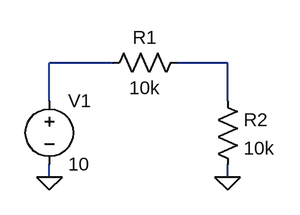
[diagram p0: schematic Draft1.asc]
Draft1.asc, the LTspice schematic file:
Version 4.1
SHEET 1 880 680
WIRE 32 144 -48 144
WIRE 176 144 112 144
WIRE -48 192 -48 144
WIRE 176 192 176 144
WIRE -48 288 -48 272
WIRE 176 288 176 272
FLAG -48 288 0
FLAG 176 288 0
SYMBOL res 128 128 R90
WINDOW 0 0 56 VBottom 2
WINDOW 3 32 56 VTop 2
SYMATTR InstName R1
SYMATTR Value 10k
SYMBOL voltage -48 176 R0
WINDOW 123 0 0 Left 0
WINDOW 39 0 0 Left 0
SYMATTR InstName V1
SYMATTR Value 10
SYMBOL res 160 176 R0
SYMATTR InstName R2
SYMATTR Value 10k

The netlist it stands for:
* Draft1.asc
R1 N002 N001 10k
V1 N001 0 10
R2 N002 0 10k
.backanno
.end